# EAGLE design RC Car v4 (EAGLE 7.2.0)
RC Car
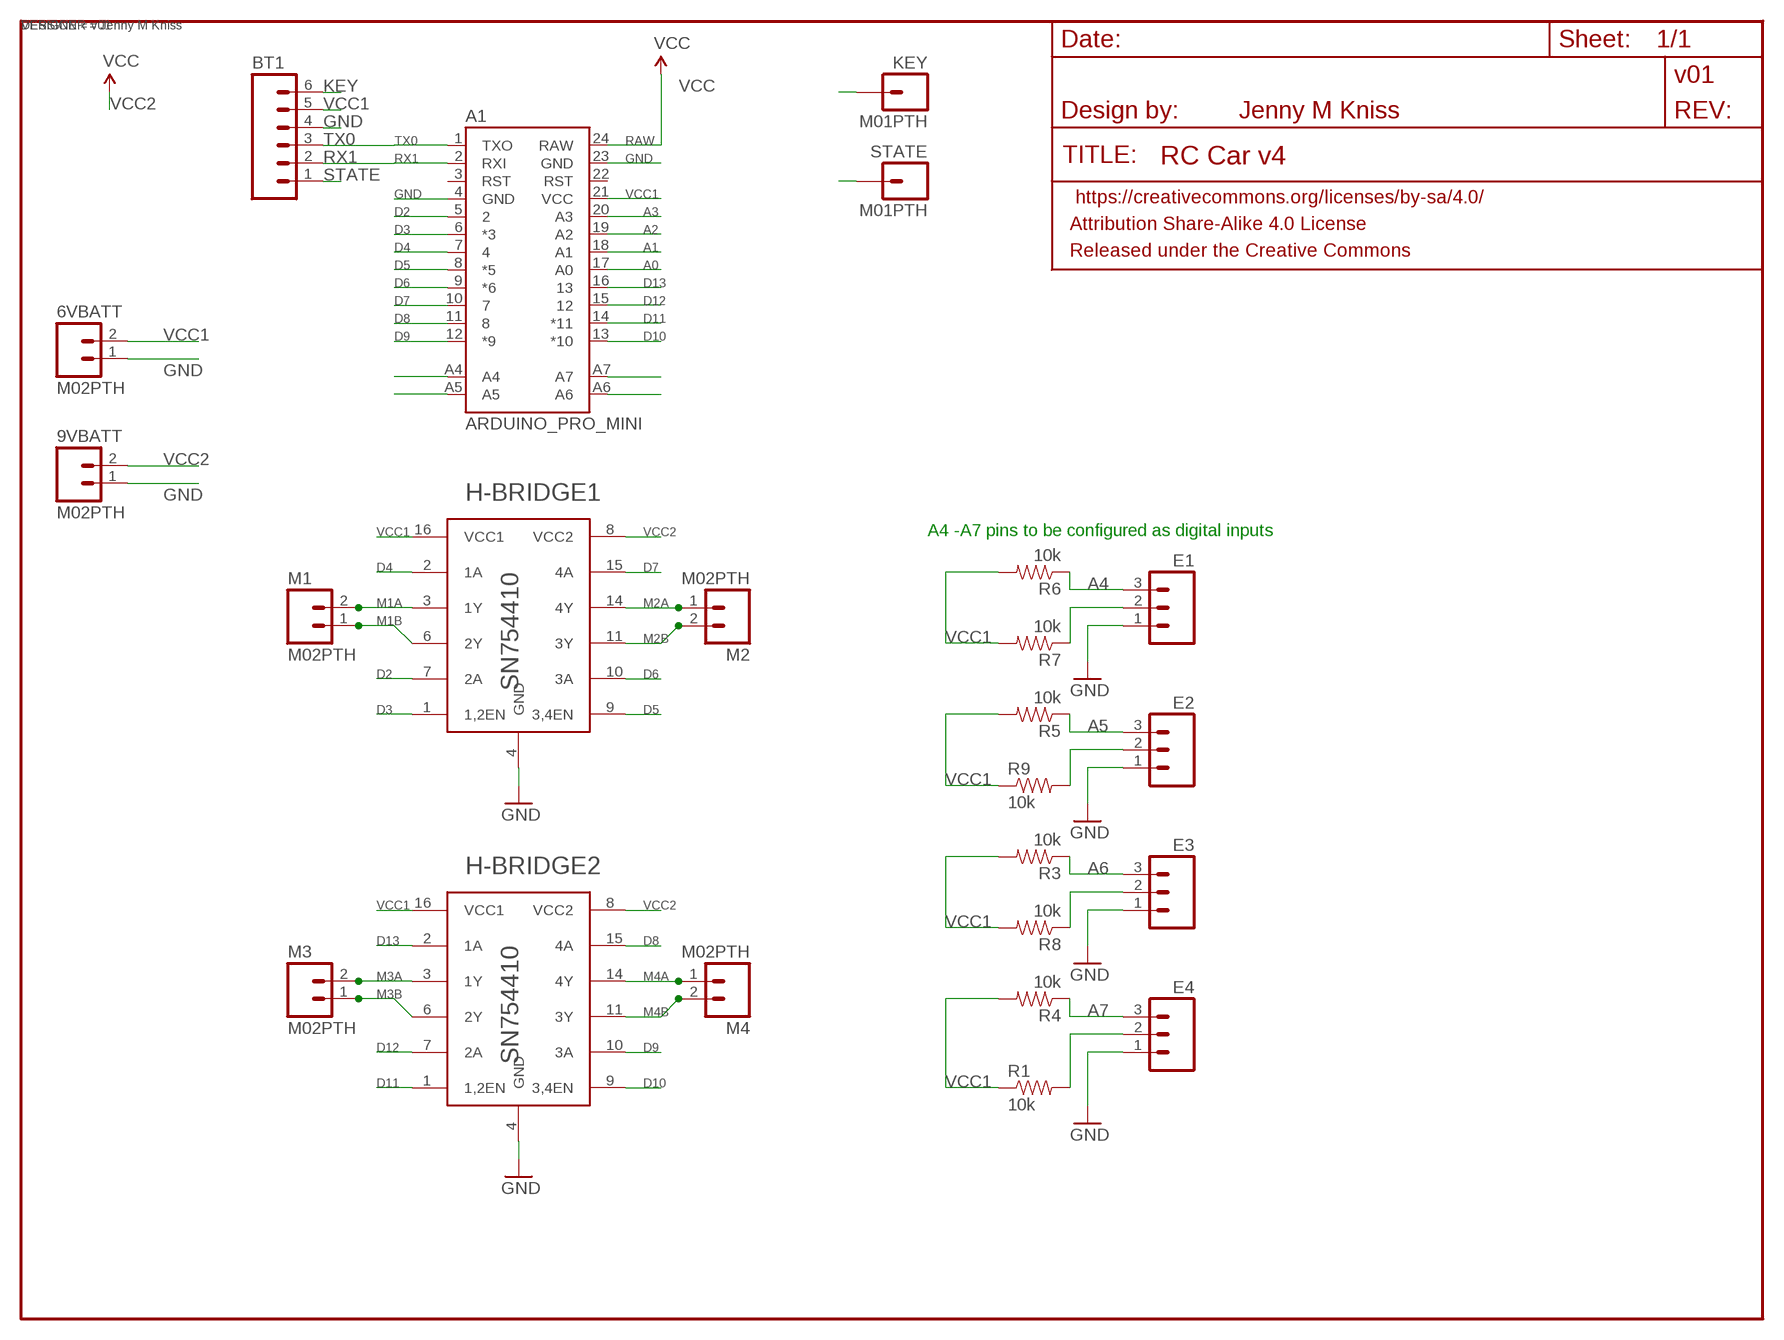
[diagram p0: schematic, sheet 1]

## Parts
6VBATT  M02PTH  [1X02]
9VBATT  M02PTH  [1X02]
A1  ARDUINO_PRO_MINI  [ARDUINO_PRO_MINI]
BT1  M06SILK_FEMALE_PTH  [1X06]
E1  M03PTH  [1X03]
E2  M03PTH  [1X03]
E3  M03PTH  [1X03]
E4  M03PTH  [1X03]
H-BRIDGE1  SN754410  [DIL16]
H-BRIDGE2  SN754410  [DIL16]
KEY  M01PTH  [1X01]
M1  M02PTH  [1X02]
M2  M02PTH  [1X02]
M3  M02PTH  [1X02]
M4  M02PTH  [1X02]
R1  10k  10KOHM-1/4W-1%(PTH)HORIZ  [AXIAL-0.3]
R3  10k  10KOHM-1/4W-1%(PTH)HORIZ  [AXIAL-0.3]
R4  10k  10KOHM-1/4W-1%(PTH)HORIZ  [AXIAL-0.3]
R5  10k  10KOHM-1/4W-1%(PTH)HORIZ  [AXIAL-0.3]
R6  10k  10KOHM-1/4W-1%(PTH)HORIZ  [AXIAL-0.3]
R7  10k  10KOHM-1/4W-1%(PTH)HORIZ  [AXIAL-0.3]
R8  10k  10KOHM-1/4W-1%(PTH)HORIZ  [AXIAL-0.3]
R9  10k  10KOHM-1/4W-1%(PTH)HORIZ  [AXIAL-0.3]
RC_CAR  JENNY M KNISS  FRAME-LETTER  [CREATIVE_COMMONS]
STATE  M01PTH  [1X01]

## Nets
A0: A1.17(A0)
A1: A1.18(A1)
A2: A1.19(A2)
A3: A1.20(A3)
A4: A1.A4 E1.3 R6.P$1
A5: A1.A5 E2.3 R5.P$1
A6: A1.A6 E3.3 R3.P$1
A7: A1.A7 E4.3 R4.P$1
D2: A1.5 H-BRIDGE1.7(2A)
D3: A1.6(*3) H-BRIDGE1.1(1,2EN)
D4: A1.7 H-BRIDGE1.2(1A)
D5: A1.8(*5) H-BRIDGE1.9(3,4EN)
D6: A1.9(*6) H-BRIDGE1.10(3A)
D7: A1.10 H-BRIDGE1.15(4A)
D8: A1.11 H-BRIDGE2.15(4A)
D9: A1.12(*9) H-BRIDGE2.10(3A)
D10: A1.13(*10) H-BRIDGE2.9(3,4EN)
D11: A1.14(*11) H-BRIDGE2.1(1,2EN)
D12: A1.15 H-BRIDGE2.7(2A)
D13: A1.16 H-BRIDGE2.2(1A)
GND: 6VBATT.1 9VBATT.1 A1.4(GND) A1.23(GND) BT1.4 E1.1 E2.1 E3.1 E4.1 H-BRIDGE1.4(GND) H-BRIDGE2.4(GND)
KEY: BT1.6 KEY.1
M1A: H-BRIDGE1.3(1Y) M1.2
M1B: H-BRIDGE1.6(2Y) M1.1
M2A: H-BRIDGE1.14(4Y) M2.1
M2B: H-BRIDGE1.11(3Y) M2.2
M3A: H-BRIDGE2.3(1Y) M3.2
M3B: H-BRIDGE2.6(2Y) M3.1
M4A: H-BRIDGE2.14(4Y) M4.1
M4B: H-BRIDGE2.11(3Y) M4.2
N$3: E2.2 R9.P$2
N$5: E1.2 R7.P$1
N$6: E3.2 R8.P$1
N$8: E4.2 R1.P$2
RAW: A1.24(RAW)
RX1: A1.2(RXI) BT1.2
STATE: BT1.1 STATE.1
TX0: A1.1(TXO) BT1.3
VCC1: 6VBATT.2 A1.21(VCC) BT1.5 H-BRIDGE1.16(VCC1) H-BRIDGE2.16(VCC1) R1.P$1 R3.P$2 R4.P$2 R5.P$2 R6.P$2 R7.P$2 R8.P$2 R9.P$1
VCC2: 9VBATT.2 H-BRIDGE1.8(VCC2) H-BRIDGE2.8(VCC2) ; supply symbol labelled VCC
Unconnected: A1.3(RST) A1.22(RST)

## Notes on the sheet
- A4 -A7 pins to be configured as digital inputs

## Power pins joined to a net without a drawn wire
GND: H-BRIDGE1.5(GND) H-BRIDGE1.12(GND) H-BRIDGE1.13(GND) H-BRIDGE2.5(GND) H-BRIDGE2.12(GND) H-BRIDGE2.13(GND)

## Library data of the parts
6VBATT 9VBATT M1-M4 = SparkFun-Connectors:M02: Standard 2-pin 0.1" header. Use with - straight break away headers ( PRT-00116) - right angle break away headers (PRT-00553) - swiss pins (PRT-00743) - machine pins (PRT-00117) - female headers (PRT-00115) Molex polarized connector foot print use with: PRT-08233 with associated crimp pins and housings. 2.54_SCREWTERM for use with PRT-10571. 3.5mm Screw Terminal footprints for PRT-08084 5mm Screw Terminal footprints for use with PRT-08432
A1 = SparkFun-Boards:ARDUINO_PRO_MINI
BT1 = SparkFun-Connectors:M06: Header 6 Standard 6-pin 0.1" header. Use with straight break away headers (SKU : PRT-00116), right angle break away headers (PRT-00553), swiss pins (PRT-00743), machine pins (PRT-00117), and female headers (PRT-00115). Molex polarized connector foot print use with SKU : PRT-08094 with associated crimp pins and housings. NOTES ON THE VARIANTS LOCK and LOCK_LONGPADS... This footprint was designed to help hold the alignment of a through-hole component (i.e. 6-pin header) while soldering it into place. You may notice that each hole has been shifted either up or down by 0.005 of an inch from it's more standard position (which is a perfectly straight line). This slight alteration caused the pins (the squares in the middle) to touch the edges of the holes. Because they are alternating, it causes a "brace" to hold the component in place. 0.005 has proven to be the perfect amount of "off-center" position when using our standard breakaway headers. Although looks a little odd when you look at the bare footprint, once you have a header in there, the alteration is very hard to notice. Also,if you push a header all the way into place, it is covered up entirely on the bottom side. This idea of altering the position of holes to aid alignment will be further integrated into the Sparkfun Library for other footprints. It can help hold any component with 3 or more connection pins.; PROD_ID: CONN-08437
E1-E4 = SparkFun-Connectors:M03: Header 3 Standard 3-pin 0.1" header. Use with straight break away headers (SKU : PRT-00116), right angle break away headers (PRT-00553), swiss pins (PRT-00743), machine pins (PRT-00117), and female headers (PRT-00115). Molex polarized connector foot print use with SKU : PRT-08232 with associated crimp pins and housings.
H-BRIDGE1 H-BRIDGE2 = DualBridge:SN754410: Quad Half-Bridge Driver
KEY STATE = SparkFun-Connectors:M01: Header 1 Standard 1-pin 0.1" header. Use with straight break away headers (SKU : PRT-00116), right angle break away headers (PRT-00553), swiss pins (PRT-00743), machine pins (PRT-00117), and female headers (PRT-00115).
R1 R3-R9 = SparkFun-Resistors:10KOHM-1/4W-1%(PTH): RES-12183; PROD_ID: RES-12183
RC_CAR = SparkFun-Aesthetics:FRAME-LETTER: Schematic Frame Standard 8.5x11 US Letter frame; DESIGNER: Jenny M Kniss; VERSION: v01

## Net classes
0 default: clearance 0.205 mm

## Board
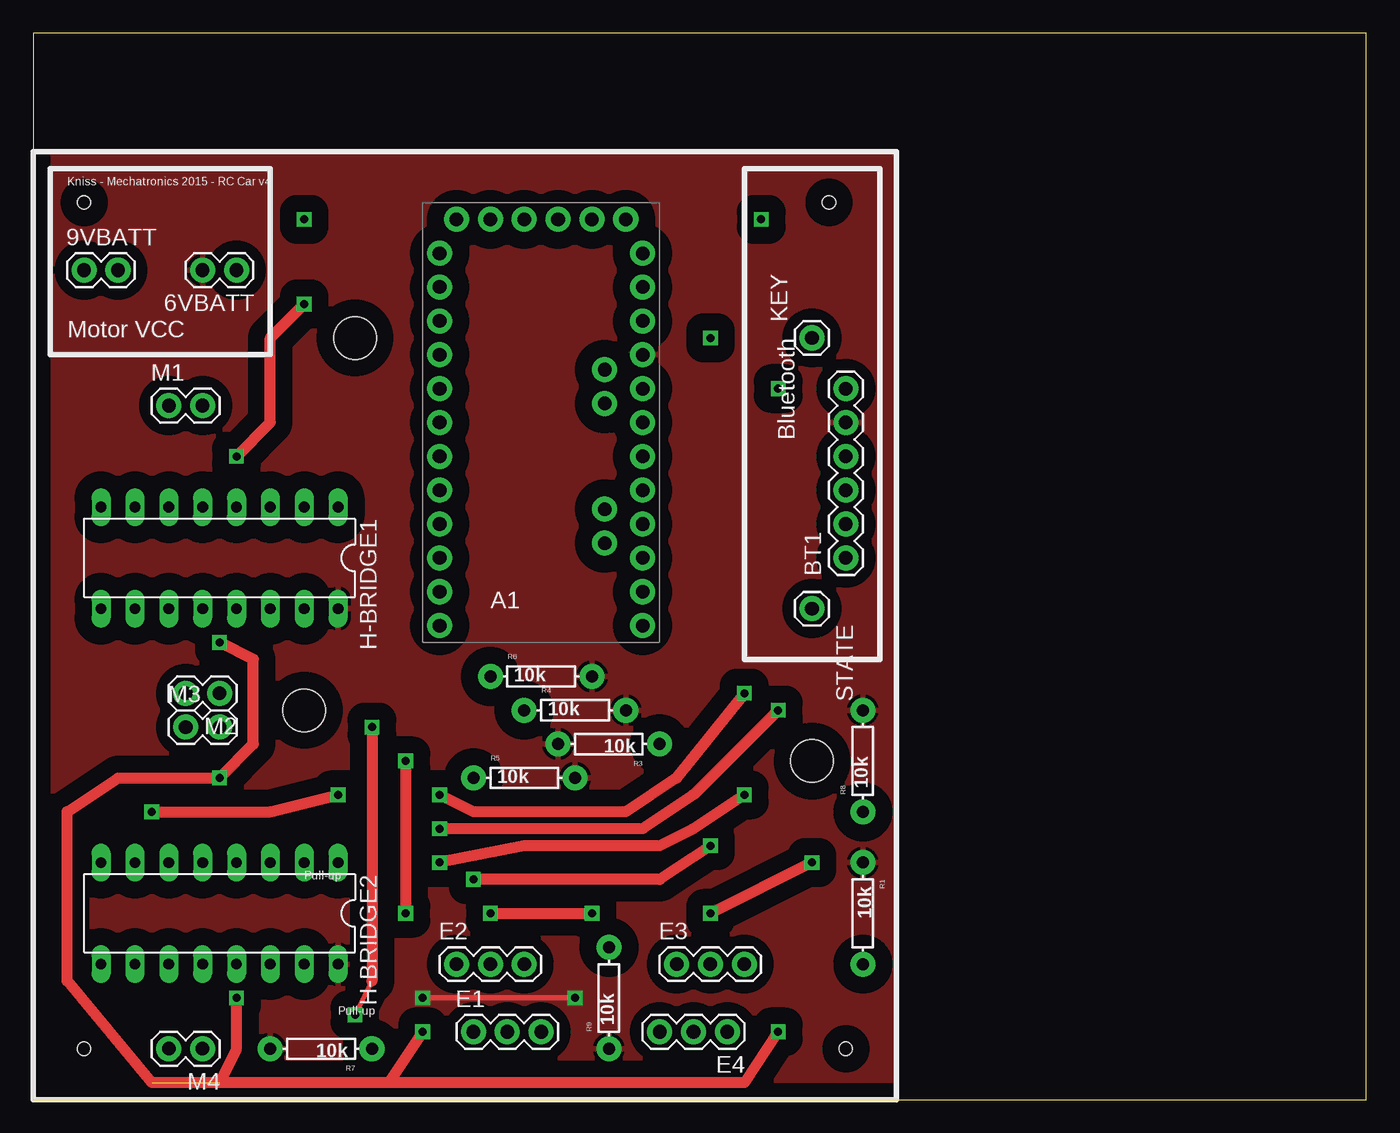
[diagram p1: board, top side]
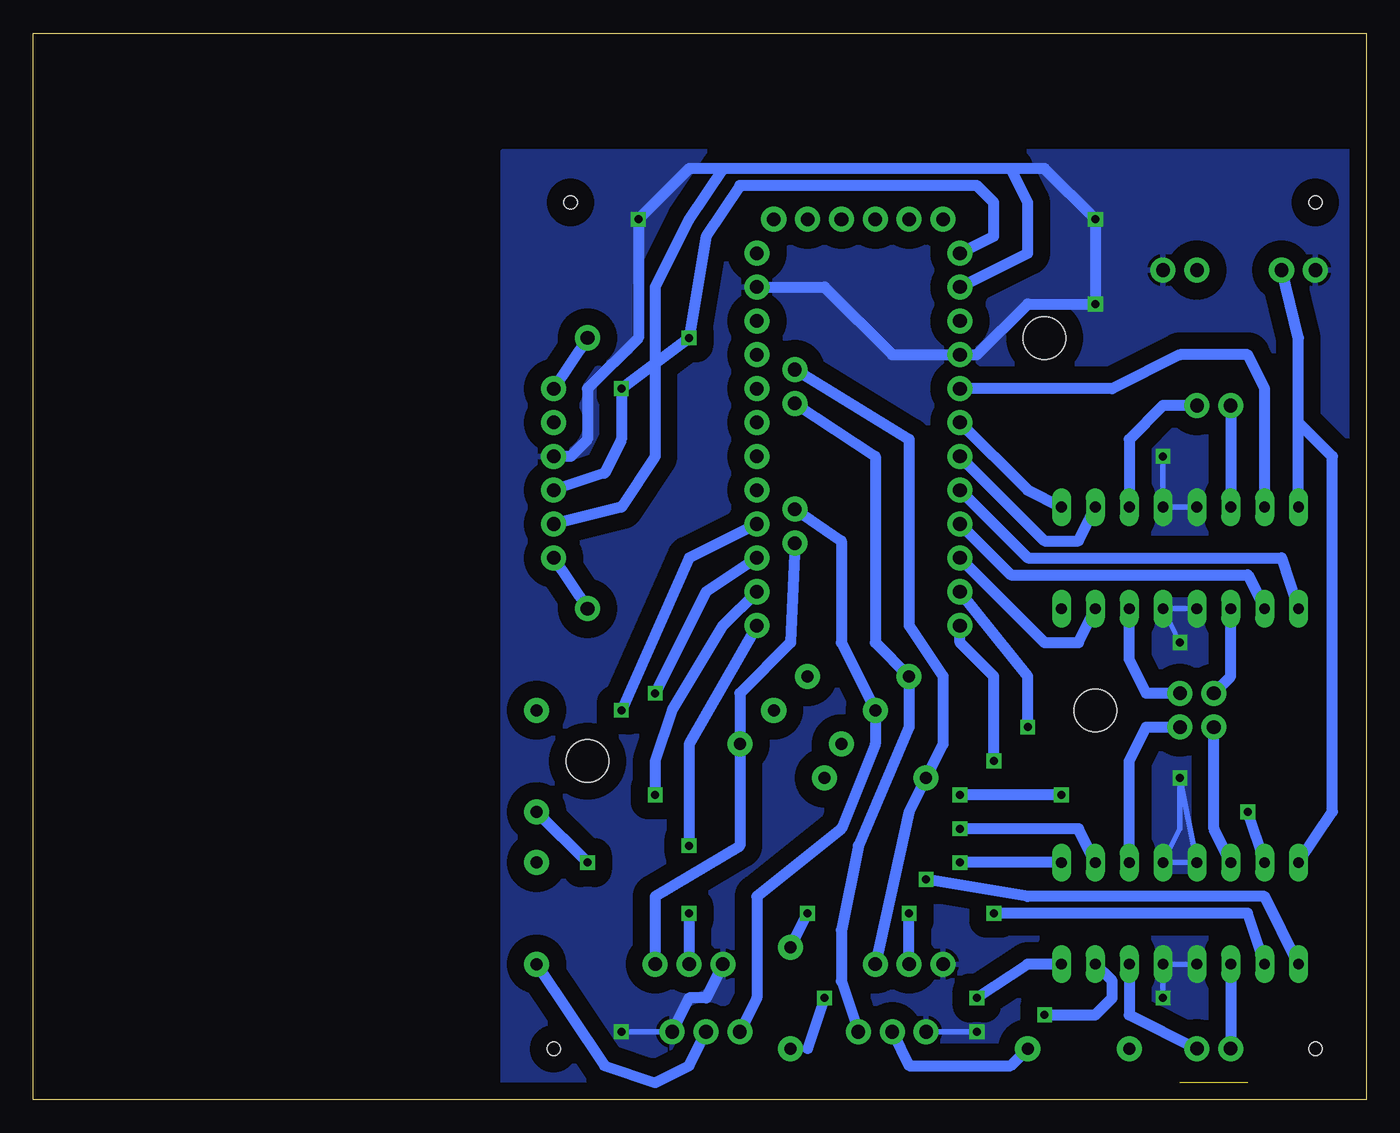
[diagram p2: board, bottom side, seen from below]

Size 100 x 80 mm. Coordinates in mm from the lower left corner, seen from the top.
Outline: 0,0 100,0 100,80 0,80 0,0
Copper layers (1*16): Top 0.035mm / dielectric 1.5mm / Bottom 0.035mm
Design rules "SparkFun": minimum track width 8mil, minimum drill 20mil, track to track 8mil, track to pad 8mil, pad to pad 8mil, via to via 8mil, smd to smd 8mil, copper to edge 8mil, drill to drill 8mil, minimum pad ring 12mil, minimum via ring 10mil, stop-mask expansion 4mil, vias tented up to drill 20mil, thermal gap 10mil
Holes 1 mm at 60.96,3.81 59.69,67.31 3.81,3.81 3.81,67.31
Holes 3.2 mm at 24.13,57.15 20.32,29.21 58.42,25.4

### Footprints (pad centres in the part's own frame; a part is rotated, then mirrored left to right if it is on the bottom)
1X02 = drill 1.016 pad 1.88: 1 0,0; 2 2.54,0
ARDUINO_PRO_MINI = drill 1.016 pad 1.88: 1 -7.62,12.7; 2 -7.62,10.16; 3 -7.62,7.62; 4 -7.62,5.08; 5 -7.62,2.54; 6 -7.62,0; 7 -7.62,-2.54; 8 -7.62,-5.08; 9 -7.62,-7.62; 10 -7.62,-10.16; 11 -7.62,-12.7; 12 -7.62,-15.24; 13 7.62,-15.24; 14 7.62,-12.7; 15 7.62,-10.16; 16 7.62,-7.62; 17 7.62,-5.08; 18 7.62,-2.54; 19 7.62,0; 20 7.62,2.54; 21 7.62,5.08; 22 7.62,7.62; 23 7.62,10.16; 24 7.62,12.7; A4 4.763,1.429; A5 4.763,3.969; A6 4.763,-9.049; A7 4.763,-6.509; BLK -6.35,15.24; GND -3.81,15.24; GRN 6.35,15.24; RXI 1.27,15.24; TXO 3.81,15.24; VCC -1.27,15.24
1X06 = drill 1.016 pad 1.88: 1 0,0; 2 2.54,0; 3 5.08,0; 4 7.62,0; 5 10.16,0; 6 12.7,0
1X03 = drill 1.016 pad 1.88: 1 0,0; 2 2.54,0; 3 5.08,0
DIL16 = drill 0.813 long: 1 -8.89,-3.81; 2 -6.35,-3.81; 3 -3.81,-3.81; 4 -1.27,-3.81; 5 1.27,-3.81; 6 3.81,-3.81; 7 6.35,-3.81; 8 8.89,-3.81; 9 8.89,3.81; 10 6.35,3.81; 11 3.81,3.81; 12 1.27,3.81; 13 -1.27,3.81; 14 -3.81,3.81; 15 -6.35,3.81; 16 -8.89,3.81
1X01 = drill 1.016 pad 1.88: 1 0,0
AXIAL-0.3 = drill 0.9 pad 1.88: P$1 -3.81,0; P$2 3.81,0

### Placement (x,y rotation side)
6VBATT  15.24,62.23 180 top
9VBATT  3.81,62.23 0 top
A1  38.1,50.8 0 top
BT1  60.96,40.64 90 top
E1  33.02,5.08 0 top
E2  31.75,10.16 0 top
E3  48.26,10.16 0 top
E4  52.07,5.08 180 top
H-BRIDGE1  13.97,40.64 180 top
H-BRIDGE2  13.97,13.97 180 top
KEY  58.42,57.15 90 top
M1  10.16,52.07 0 top
M2  13.97,30.48 180 top
M3  11.43,27.94 0 top
M4  12.7,3.81 180 top
R1  62.23,13.97 270 top
R3  43.18,26.67 180 top
R4  40.64,29.21 0 top
R5  36.83,24.13 0 top
R6  38.1,31.75 0 top
R7  21.59,3.81 180 top
R8  62.23,25.4 90 top
R9  43.18,7.62 90 top
RC_CAR  21.59,72.39 0 top
STATE  58.42,36.83 270 top

### Tracks (layer width: path | path; a pad name or v marks a point on that pad's centre or on a via)
A4
  Bottom 0.813: A1.A4 36.83,48.26 36.83,34.29 R6.P$1 34.29,27.94 38.1,19.05 39.37,12.7 39.37,8.89 E1.3
A5
  Bottom 0.813: A1.A5 34.29,49.53 34.29,35.56 31.75,31.75 31.75,26.67 R5.P$1 34.29,21.59 E2.3
A6
  Bottom 0.813: E3.3 53.34,15.24 46.99,19.05 R3.P$1 46.99,30.48 43.18,34.29 A1.A6
A7
  Bottom 0.813: E4.3 45.72,7.62 45.72,15.24 39.37,20.32 36.83,26.67 R4.P$1 39.37,34.29 39.37,41.91 A1.A7
D2
  Bottom 0.813: H-BRIDGE1.7 7.62,53.34 8.89,55.88 13.97,55.88 19.05,53.34 A1.5
D3
  Bottom 0.813: A1.6 25.4,45.72 H-BRIDGE1.1
D4
  Bottom 0.813: A1.7 24.13,41.91 21.59,41.91 H-BRIDGE1.2
D5
  Bottom 0.813: A1.8 25.4,40.64 6.35,40.64 H-BRIDGE1.9
D6
  Bottom 0.813: A1.9 26.67,39.37 8.89,39.37 H-BRIDGE1.10
D7
  Bottom 0.813: A1.10 24.13,34.29 21.59,34.29 H-BRIDGE1.15
D8  (via drill 0.6)
  Top 0.406: 25.4,8.89 v24.13,6.35
  Top 0.813: v25.4,27.94 25.4,8.89
  Bottom 0.813: v24.13,6.35 20.32,6.35 19.05,7.62 19.05,8.89 H-BRIDGE2.15 | v25.4,27.94 25.4,31.75 A1.11
D9  (via drill 0.6)
  Top 0.813: v27.94,25.4 v27.94,13.97
  Bottom 0.813: v27.94,13.97 8.89,13.97 H-BRIDGE2.10 | v27.94,25.4 27.94,31.75 30.48,34.29 A1.12
D10  (via drill 0.6)
  Top 0.813: v50.8,19.05 46.99,16.51 v33.02,16.51
  Bottom 0.813: A1.13 50.8,26.67 v50.8,19.05 | H-BRIDGE2.9 7.62,15.24 25.4,15.24 v33.02,16.51
D11  (via drill 0.6)
  Top 0.813: v53.34,22.86 49.53,20.32 46.99,19.05 36.83,19.05 v30.48,17.78
  Bottom 0.813: A1.14 48.26,35.56 52.07,29.21 53.34,25.4 v53.34,22.86 | H-BRIDGE2.1 v30.48,17.78
D12  (via drill 0.6)
  Top 0.813: v53.34,30.48 48.26,24.13 44.45,21.59 33.02,21.59 v30.48,22.86 | v8.89,21.59 17.78,21.59 v22.86,22.86
  Bottom 0.813: A1.15 49.53,38.1 v53.34,30.48 | v22.86,22.86 v30.48,22.86 | H-BRIDGE2.7 v8.89,21.59
D13  (via drill 0.6)
  Top 0.813: v55.88,29.21 49.53,22.86 45.72,20.32 v30.48,20.32
  Bottom 0.813: A1.16 50.8,40.64 v55.88,29.21 | v30.48,20.32 21.59,20.32 H-BRIDGE2.2
GND  (via drill 0.6)  (1 unrouted)
  Top 0.813: v55.88,5.08 53.34,1.27 26.67,1.27 | v29.21,5.08 26.67,1.27 | 26.67,1.27 8.89,1.27 2.54,8.89 2.54,21.59 6.35,24.13 v13.97,24.13 16.51,26.67 16.51,33.02 v13.97,34.29 | v15.24,7.62 15.24,3.81 13.97,1.27 | v15.24,48.26 17.78,50.8 17.78,57.15 v20.32,59.69
  Bottom 0.406: v15.24,48.26 H-BRIDGE1.4 H-BRIDGE1.5 | v55.88,5.08 E4.1 | H-BRIDGE1.12 H-BRIDGE1.13 v13.97,34.29 | H-BRIDGE2.12 H-BRIDGE2.13 v15.24,7.62 | E1.1 v29.21,5.08 | v13.97,24.13 H-BRIDGE2.5 H-BRIDGE2.4 13.97,20.32 v13.97,24.13
  Bottom 0.813: E3.1 49.53,7.62 50.8,7.62 E4.1 | BT1.4 59.69,48.26 58.42,49.53 58.42,53.34 54.61,57.15 v54.61,66.04 50.8,69.85 24.13,69.85 v20.32,66.04 v20.32,59.69 25.4,59.69 29.21,55.88 A1.4 35.56,55.88 40.64,60.96 A1.23
  pour Bottom (isolate 1.27): 0,0 0,71.12 64.77,71.12 64.77,0
KEY
  Bottom 0.813: KEY.1 BT1.6
M1A
  Bottom 0.813: M1.2 15.24,52.07 17.78,49.53 H-BRIDGE1.3
M1B
  Bottom 0.813: M1.1 H-BRIDGE1.6
M2A
  Bottom 0.813: M2.1 16.51,30.48 17.78,33.02 H-BRIDGE1.14
M2B
  Bottom 0.813: M2.2 10.16,31.75 H-BRIDGE1.11
M3A
  Bottom 0.813: H-BRIDGE2.3 17.78,25.4 16.51,27.94 M3.2
M3B
  Bottom 0.813: H-BRIDGE2.6 11.43,20.32 M3.1
M4A
  Bottom 0.813: H-BRIDGE2.14 17.78,6.35 M4.1
M4B
  Bottom 0.813: H-BRIDGE2.11 M4.2
N$3  (via drill 0.6)
  Top 0.813: v34.29,13.97 v41.91,13.97
  Bottom 0.813: R9.P$2 v41.91,13.97 | E2.2 v34.29,13.97
N$5
  Bottom 0.813: E1.2 34.29,2.54 26.67,2.54 R7.P$1
N$6  (via drill 0.6)
  Top 0.813: v58.42,17.78 v50.8,13.97
  Bottom 0.813: R8.P$1 v58.42,17.78 | v50.8,13.97 E3.2
N$8
  Bottom 0.813: R1.P$2 57.15,2.54 53.34,1.27 50.8,2.54 E4.2
RX1
  Bottom 0.813: A1.2 25.4,63.5 25.4,67.31 26.67,69.85 48.26,69.85 50.8,66.04 53.34,60.96 53.34,48.26 55.88,44.45 BT1.2
STATE
  Bottom 0.813: BT1.1 STATE.1
TX0  (via drill 0.6)
  Bottom 0.813: A1.1 27.94,64.77 27.94,67.31 29.21,68.58 46.99,68.58 49.53,64.77 v50.8,57.15 v55.88,53.34 55.88,49.53 57.15,46.99 BT1.3
VCC1  (via drill 0.6)
  Top 0.406: v40.64,7.62 v29.21,7.62
  Bottom 0.406: 41.91,3.81 R9.P$1
  Bottom 0.813: v40.64,7.62 41.91,3.81 | H-BRIDGE2.16 25.4,10.16 v29.21,7.62
  pour Top (isolate 1.27): 0,0 0,71.12 64.77,71.12 64.77,0
VCC2
  Bottom 0.813: H-BRIDGE2.8 2.54,21.59 2.54,48.26 5.08,50.8 | H-BRIDGE1.8 5.08,50.8 | 5.08,50.8 5.08,57.15 9VBATT.2

### Text on the board
tNames: Kniss - Mechatronics 2015 - RC Car v4 | Motor VCC | Bluetooth | Pull-up | Pull-up